# Altium schematic sheet npm1300_qeaa_config2.SchDoc: nPM1300-QEAA Ref. Layout Config. 2
size A4; Revision: 1.2; SheetNumber: 1; SheetTotal: 1; DrawnBy: EISK; DocumentSize: A4; BoardTitle: nPM1300-QEAA Ref. Layout Config. 2; PCAName: nPM1300-QEAA; RefLayoutTitle: Simple – one BUCK, LOADSW and LED; Device: nPM1300-QEAA; Classification: PUBLIC; Config: 2
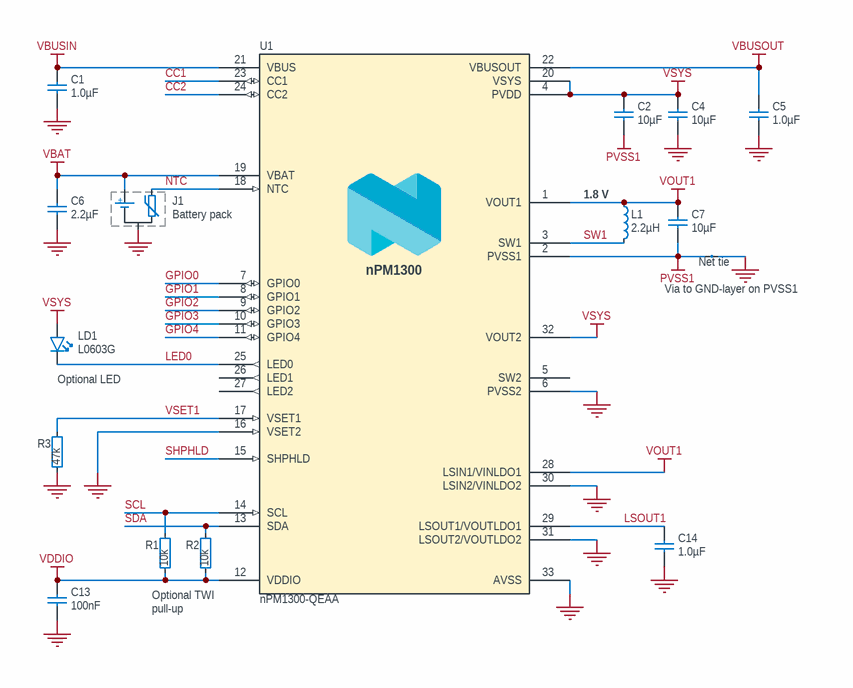
[diagram p0: npm1300_qeaa_config2.SchDoc]

## Parts
C1  1.0µF  [CAPC1608X06L]
C2  10µF  [CAPC1608X06L]
C4  10µF  [CAPC1608X06L]
C5  1.0µF  [CAPC1608X06L]
C6  2.2µF  [CAPC1608X06L]
C7  10µF  [CAPC1608X06L]
C13  100nF  [CAPC0603X03L_C]
C14  1.0µF  [CAPC1608X06L]
J1  Battery pack  [TP_3x1mm_TH]  (graphical)
L1  2.2µH  [INDC2016X10N]
LD1  L0603G  [LED_0603_G]  (graphical)
NT1  Net tie  [2 PIN STARPOINT]  (net tie, no BOM)
R1  10k  [RESC0603X03L_C]
R2  10k  [RESC0603X03L_C]
R3  47k  [RESC0603X03L_C]
U1  nPM1300-QEAA  [Nordic_QFN50P500X500X90-33N]

## Nets
GND: C1.1 C4.1 C5.1 C6.1 C13.2 C14.1 J1.1(GND) NT1.1 R3.2 U1.6(PVSS2) U1.16(VSET2) U1.30(LSIN2/VINLDO2) U1.31(LSOUT2/VOUTLDO2) U1.33(AVSS)
PVSS1: C2.1 C7.1 NT1.2 U1.2(PVSS1)
VBAT: C6.2 J1.3(V+) U1.19(VBAT)
VBUSIN: C1.2 U1.21(VBUS)
VBUSOUT: C5.2 U1.22(VBUSOUT)
VDDIO: C13.1 R1.2 R2.2 U1.12(VDDIO)
VOUT1: C7.2 L1.1 U1.1(VOUT1) U1.28(LSIN1/VINLDO1)
VSYS: C2.2 C4.2 LD1.2(A) U1.4(PVDD) U1.20(VSYS) U1.32(VOUT2)
CC1: U1.23(CC1)
CC2: U1.24(CC2)
GPIO0: U1.7(GPIO0)
GPIO1: U1.8(GPIO1)
GPIO2: U1.9(GPIO2)
GPIO3: U1.10(GPIO3)
GPIO4: U1.11(GPIO4)
LED0: LD1.1(C) U1.25(LED0)
LSOUT1: C14.2 U1.29(LSOUT1/VOUTLDO1)
NTC: J1.2(NTC) U1.18(NTC)
SCL: R1.1 U1.14(SCL)
SDA: R2.1 U1.13(SDA)
SHPHLD: U1.15(SHPHLD)
SW1: L1.2 U1.3(SW1)
VSET1: R3.1 U1.17(VSET1)

Not connected (* = marked no-connect by the designer): U1 5(SW2) 26(LED1) 27(LED2)

## Notes on the sheet
- (near L1) 1.8 V
- (near NT1) Via to GND-layer on PVSS1
- (near LD1) Optional LED
- Optional TWI pull-up resistors
- Title
- Size
- Date:
- File:
- A4
- Config. No.
- Device
- Sheet
- Drawn By:
- Revision
- of
- Nordic Semiconductor does not warrant the accuracy or completeness of this documentation or any included information. Nordic Semiconductor makes no assurances that this design will meet specification, be appropriate for your application, or fit for any particular purpose, or that it will function in an implementation. Nordic Semiconductor also does not claim that the design is ready for production. It is your responsibility to thoroughly validate and test your design implementation to confirm the functionality of your application.
  © Nordic Semiconductor — All rights reserved.
- Classification:
- (in symbol Battery_w/NTC_TP) +
- (in symbol nPM1300-QEAA) nPM1300

## Library data of the parts
C1 C5 C14 = C0603-1µ0-10V-X5R: Capacitor, Ceramic, 1.0µF 10V X5R 0603,±10%; Manufacturer: N.A.; Part number NEMS: 100200528; Pad Count: 2; Component Status: Active; Part Number: C0603-1µ0-10V-X5R; Manufacturer Part Number: N.A.; Footprint Doc: 0603; LatestRevisionDate: 2022-10-06; Published: 2022-10-06; Value: 1.0µF; Note: 10V; Artikkelnr Noca: N.A.; Part number IPS: N.A.; ComponentLink1URL: N.A.; ComponentLink1Description: Datasheet; ComponentLink2URL: N.A.; ComponentLink2Description: Supplier link; HelpURL: N.A.; Supplier 1: N.A.; Supplier Part Number 1: N.A.; Supplier 2: N.A.; Supplier Part Number 2: N.A.; Component Class: Capacitors; PartId: 100200528; Author: getr; Part number Norautron: N.A.
C2 C4 C7 = C0603-10µ-10V-X5R: Capacitor, Ceramic, X5R, ±20%, 10V; Manufacturer: N.A.; Part number Norautron: 262085341; Part number NEMS: 100200481; Pad Count: 2; Component Status: Active; Part Number: C0603-10µ-10V-X5R; Manufacturer Part Number: N.A.; ComponentLink1URL: N.A.; ComponentLink1Description: Datasheet; ComponentLink2URL: N.A.; ComponentLink2Description: Supplier link; HelpURL: N.A.; Footprint Doc: 0603; LatestRevisionDate: 2021-07-22; Published: 2021-07-22; Value: 10µF; Note: 10V; Supplier 1: N.A.; Supplier Part Number 1: N.A.; Supplier 2: N.A.; Supplier Part Number 2: N.A.; Artikkelnr Noca: N.A.; Part number IPS: N.A.; Component Class: Capacitors; PartId: 100200481; Author: rubr
C6 = C0603-2µ2-25V-X5R-GRM188R61E225KA12D: Capacitor, Ceramic, X5R, ±10%, 25V; Manufacturer: Murata; Part number NEMS: 100200454; Component Status: Active; Pad Count: 2; Artikkelnr Noca: N.A.; Part Number: C0603-2µ2-25V-X5R-GRM188R61E225KA12D; PartId: 100200454; Component Class: Capacitors; Author: rsk; Manufacturer Part Number: GRM188R61E225KA12D; ComponentLink1URL: https://search.murata.co.jp/Ceramy/image/img/A01X/G101/ENG/GRM188R61E225KA12-01.pdf; ComponentLink1Description: Datasheet; ComponentLink2URL: https://www.murata.com/en-global/products/productdetail?partno=GRM188R61E225KA12%23; ComponentLink2Description: Supplier link; HelpURL: N.A.; LatestRevisionDate: 2021-07-22; Published: 2020-12-16; Footprint Doc: 0603; Value: 2.2µF; Note: 25V; Supplier 1: Digi-Key; Supplier Part Number 1: 490-10731-1-ND; Supplier 2: Mouser; Supplier Part Number 2: 81-GRM188R61E225KA2D; Part number IPS: N.A.; Part number Norautron: N.A.
C13 = C0201-100n-25V-X5R: Capacitor, Ceramic, X5R, ±10%, 25V; Manufacturer: Murata; Manufacturer Part Number: GRM033R61E104KE14J; Part number NEMS: 100200459; Pad Count: 2; Artikkelnr Noca: N.A.; Component Status: Active; Part Number: C0201-100n-25V-X5R; PartId: 100200459; Component Class: Capacitors; Author: rsk; ComponentLink1URL: https://search.murata.co.jp/Ceramy/image/img/A01X/G101/ENG/GRM033R61E104KE14-01.pdf; ComponentLink1Description: Datasheet; ComponentLink2URL: https://www.murata.com/en-global/products/productdetail?partno=GRM033R61E104KE14%23; ComponentLink2Description: Supplier link; HelpURL: N.A.; Footprint Doc: 0201; LatestRevisionDate: 2020-12-16; Published: 2020-12-16; Value: 100nF; Note: 25V; Supplier 1: Digi-Key; Supplier Part Number 1: 490-14571-1-ND; Supplier 2: Mouser; Supplier Part Number 2: 81-GRM033R61E104KE4J; Part number IPS: N.A.; Part number Norautron: N.A.
J1 = Battery_w/NTC_TP: Battery pack with NTC; Manufacturer: N.A.; Part number NEMS: 101800005; Pad Count: 3; Component Status: Active; Footprint Doc: TP_3x1mm_TH; Value: Battery pack; Component Class: Batteries; Author: rsk; Part Number: Battery_w/NTC_TP; PartId: 101800005; Manufacturer Part Number: N.A.; ComponentLink1URL: N.A.; ComponentLink1Description: Datasheet; ComponentLink2URL: N.A.; ComponentLink2Description: Supplier link; HelpURL: N.A.; LatestRevisionDate: 2020-09-21; Published: 2020-09-21; Note: N.A.; Supplier 1: N.A.; Supplier Part Number 1: N.A.; Supplier 2: N.A.; Supplier Part Number 2: N.A.; Artikkelnr Noca: N.A.; Part number IPS: N.A.; Part number Norautron: N.A.
L1 = L0806-2µ2-2500mA-73mOhm-CIGT201610EH2R2MNE: Inductor, Irms=2.5A, Isat=2.9A, ±20%, DCR=73mΩ; Manufacturer: Samsung Electro-Mechanics America; Part number Norautron: 26521789; Part number NEMS: 100300400; Pad Count: 2; Note: Unshielded Thin Film Inductor; Artikkelnr Noca: N.A.; Component Status: Active; Part Number: L0806-2µ2-2500mA-73mOhm-CIGT201610EH2R2MNE; PartId: 100300400; Component Class: Inductors; Author: rsk; Manufacturer Part Number: CIGT201610EH2R2MNE; ComponentLink1URL: https://media.digikey.com/pdf/Data%20Sheets/Samsung%20PDFs/CIGT201610EH2R2MNE_Spec.pdf; ComponentLink1Description: Datasheet; ComponentLink2URL: https://www.digikey.com/en/products/detail/samsung-electro-mechanics/CIGT201610EH2R2MNE/7041223?s=N4IgTCBcDaIMIEkDiAVMAGAjANk%2BgogBJgBKYAsgHL4gC6AvkA; ComponentLink2Description: Supplier link; HelpURL: http://product.samsungsem.com/pi/CIGT201610EH2R2MN.do; Footprint Doc: 0806; LatestRevisionDate: 2022-09-07; Published: 2021-02-03; Value: 2.2µH; Supplier 1: Digi-Key; Supplier Part Number 1: 1276-6901-1-ND; Supplier 2: Mouser; Supplier Part Number 2: 187-CIGT201610EH2R2M; Part number IPS: N.A.
LD1 = 150060GS55040: LED 0603 GREEN; Manufacturer: Wurth Elektronik; Part number NEMS: 101400140; Component Status: Active; Pad Count: 2; Note: 60 mcd @ 20 mA; Artikkelnr Noca: N.A.; Part Number: 150060GS55040; PartId: 101400140; Component Class: Optoelectronics; Author: kjp; Manufacturer Part Number: 150060GS55040; ComponentLink1URL: https://no.mouser.com/datasheet/2/445/150060GS55040-1714515.pdf; ComponentLink1Description: Datasheet; ComponentLink2URL: https://no.mouser.com/ProductDetail/Wurth-Elektronik/150060GS55040?qs=fAHHVMwC%252Bbhr5Aln2oA6Nw%3D%3D; ComponentLink2Description: Supplier link; HelpURL: N.A.; LatestRevisionDate: 2022-01-27; Published: 2022-01-27; Footprint Doc: 0603; Value: L0603G; Supplier 1: Mouser; Supplier Part Number 1: 710-150060GS55040; Supplier 2: Digi-Key; Supplier Part Number 2: 732-12014-2-ND; Part number IPS: N.A.; Part number Norautron: N.A.
NT1 = 2 pin starpoint: Starpoint; Manufacturer: N.A.; Part number NEMS: 100500603; Pad Count: 2; Component Status: Active; Part Number: 2 pin starpoint; Manufacturer Part Number: N.A.; ComponentLink1URL: N.A.; ComponentLink1Description: Datasheet; ComponentLink2URL: N.A.; ComponentLink2Description: Supplier link; HelpURL: N.A.; Footprint Doc: N.A.; LatestRevisionDate: 2017-08-31; Published: 2017-08-31; Value: Net tie; Note: N.A.; Supplier 1: N.A.; Supplier Part Number 1: N.A.; Supplier 2: N.A.; Supplier Part Number 2: N.A.; Artikkelnr Noca: N.A.; Part number IPS: N.A.; Component Class: Connectors; PartId: 100500603; Author: rsk; Part number Norautron: N.A.
R1 R2 = R0201-10k: Resistor, ±1%, 0.05W; Manufacturer: N.A.; Part number IPS: 00000001255; Part number Norautron: 26107101; Part number NEMS: 100100065; Pad Count: 2; Note: Chip Res 1%; Component Status: Active; Part Number: R0201-10k; PartId: 100100065; Component Class: Resistors; Author: rsk; Manufacturer Part Number: N.A.; ComponentLink1URL: N.A.; ComponentLink1Description: Datasheet; ComponentLink2URL: N.A.; ComponentLink2Description: Supplier link; HelpURL: N.A.; Footprint Doc: 0201; LatestRevisionDate: 2014-11-13; Published: 2014-11-13; Value: 10k; Supplier 1: N.A.; Supplier Part Number 1: N.A.; Supplier 2: N.A.; Supplier Part Number 2: N.A.; Artikkelnr Noca: N.A.
R3 = R0201-47k: Resistor, ±1%, 0.05W; Manufacturer: N.A.; Part number IPS: 00000001423; Part number NEMS: 100100076; Component Status: Active; Pad Count: 2; Note: Chip Res 1%; Part Number: R0201-47k; PartId: 100100076; Component Class: Resistors; Author: rsk; Manufacturer Part Number: N.A.; ComponentLink1URL: N.A.; ComponentLink1Description: Datasheet; ComponentLink2URL: N.A.; ComponentLink2Description: Supplier link; HelpURL: N.A.; LatestRevisionDate: 2014-11-13; Published: 2014-11-13; Footprint Doc: 0201; Value: 47k; Supplier 1: N.A.; Supplier Part Number 1: N.A.; Supplier 2: N.A.; Supplier Part Number 2: N.A.; Artikkelnr Noca: N.A.; Part number Norautron: N.A.
U1 = nPM1300-QEAA: Li-Ion/Li-Polymer USB-C battery charger with high efficiency buck regulators, LDOs or load switches, LED drivers, TWI and VBUSOUT; Manufacturer: Nordic Semiconductor; Part number NEMS: 102000252; Component Status: Active; Pad Count: 33; Note: N.A.; Part Number: nPM1300-QEAA; PartId: 102000252; Component Class: nRF_Devices; Author: eisk; Manufacturer Part Number: nPM1300-QEAA; ComponentLink1URL: N.A.; ComponentLink1Description: Datasheet; ComponentLink2URL: N.A.; ComponentLink2Description: Supplier link; HelpURL: N.A.; LatestRevisionDate: 2022-11-14; Published: 2022-02-17; Footprint Doc: QFN-32; Value: nPM1300-QEAA; Supplier 1: Nordic Semiconductor; Supplier Part Number 1: nPM1300-QEAA; Supplier 2: N.A.; Supplier Part Number 2: N.A.; Artikkelnr Noca: N.A.; Part number IPS: N.A.; Part number Norautron: N.A.